# Altium schematic sheet stm32f407z.SchDoc
size A3
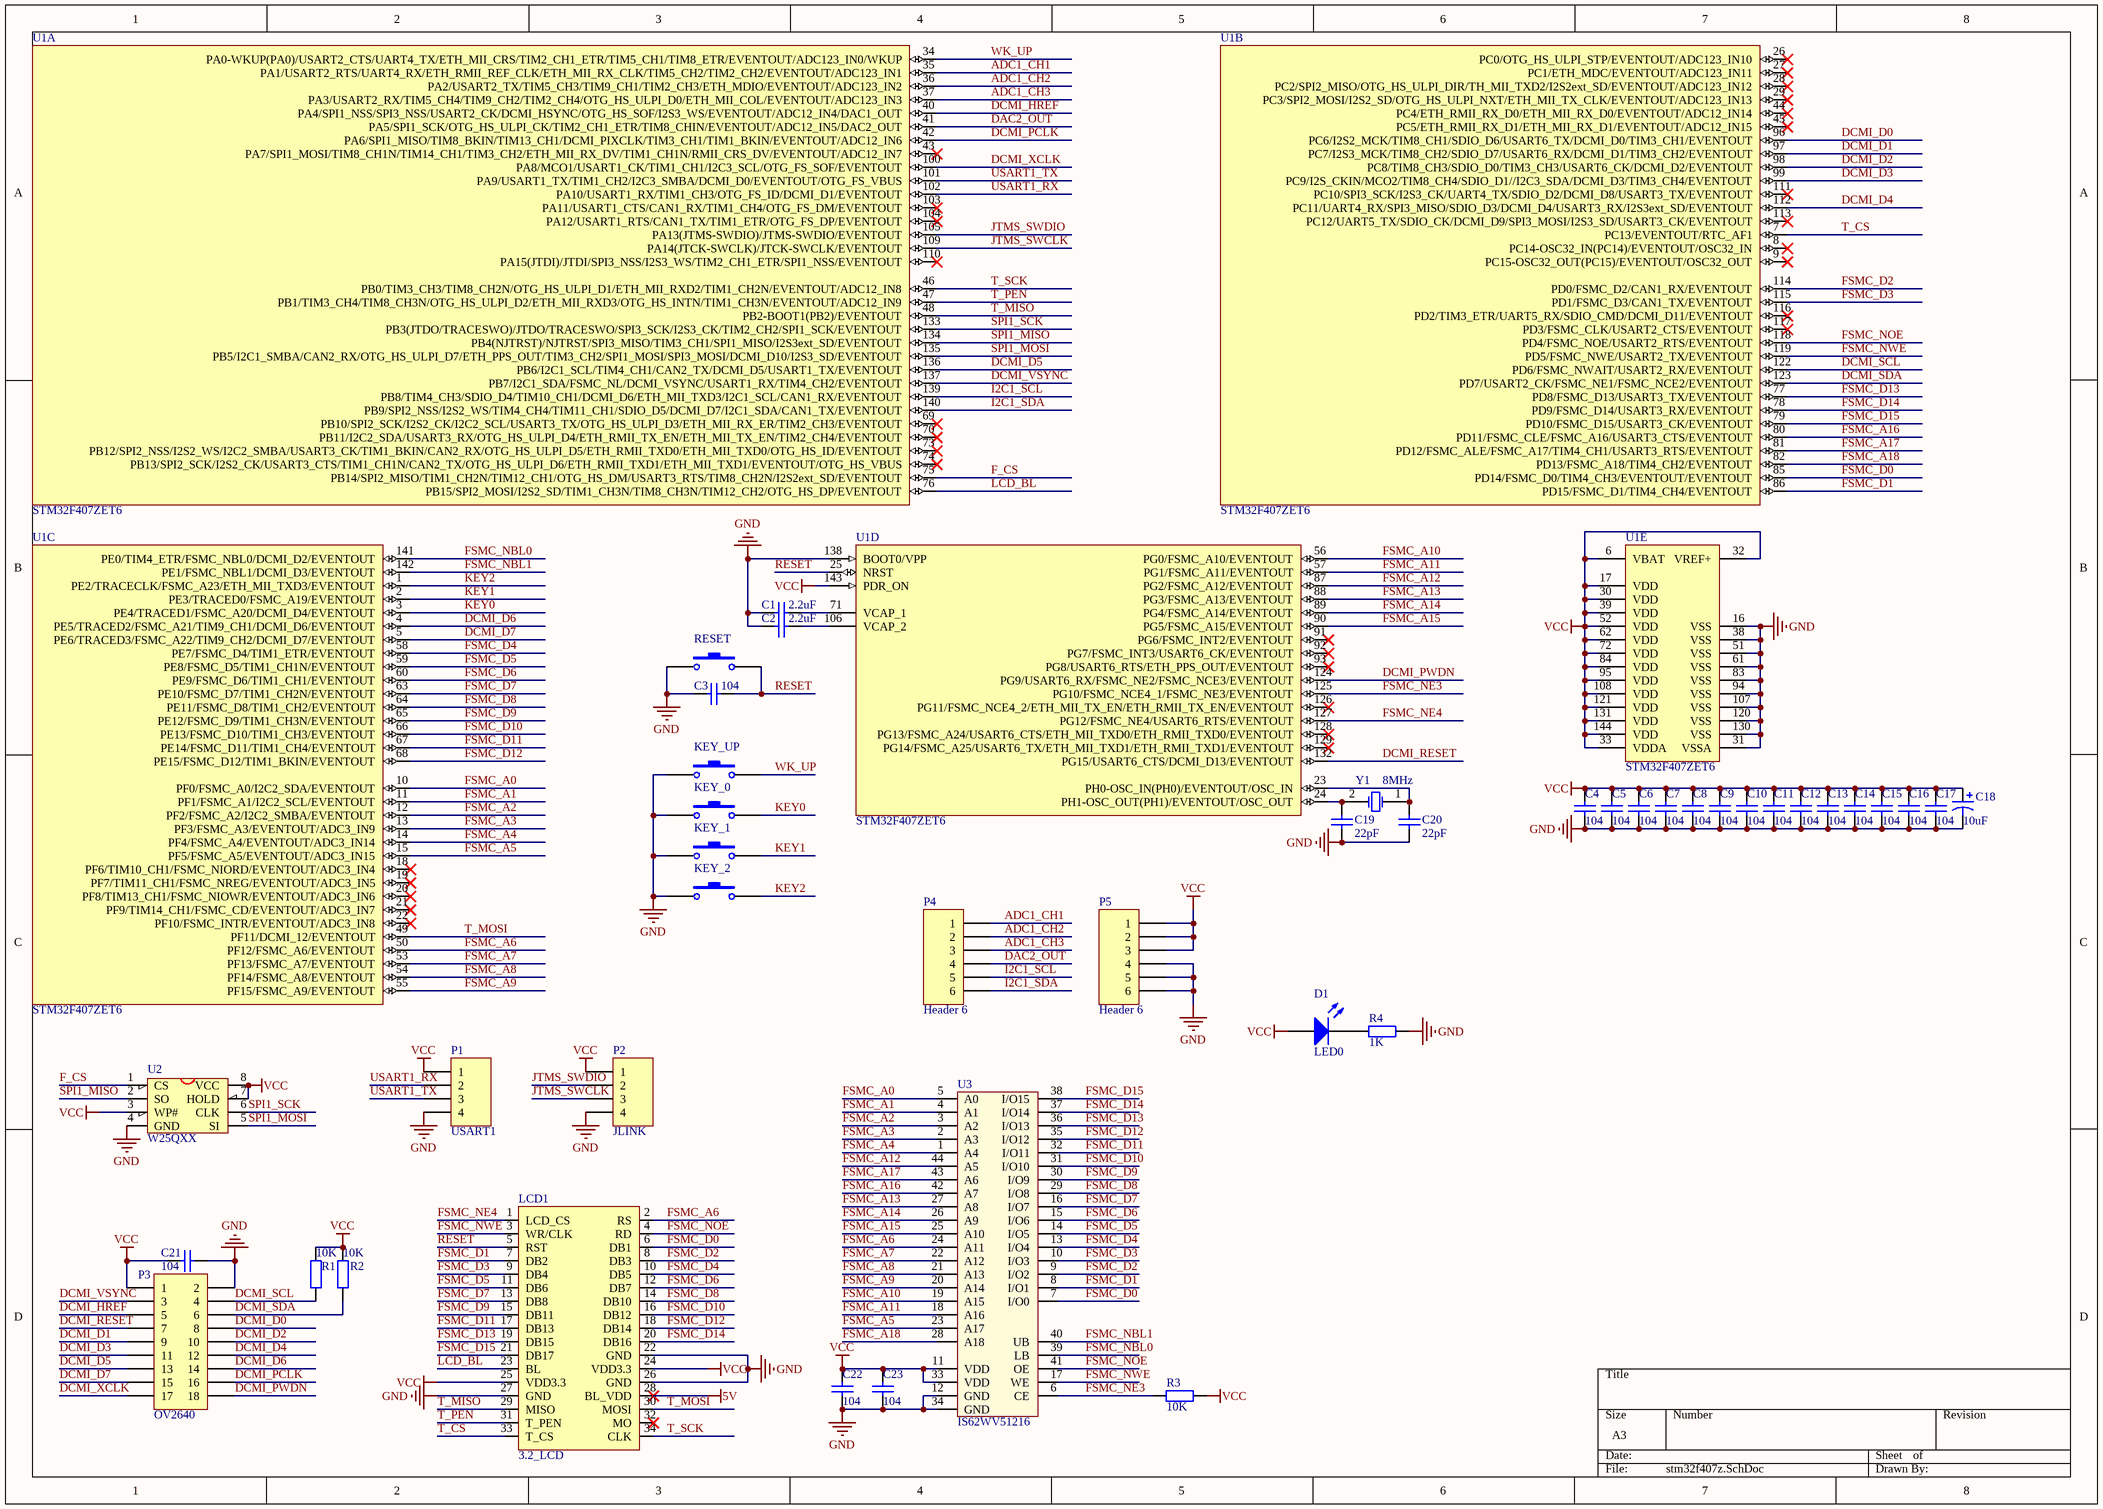
[diagram p0: stm32f407z.SchDoc]

## Parts
C1  2.2uF  [C0603]
C2  2.2uF  [C0603]
C3  104  [C0603]
C4  104  [C0603]
C5  104  [C0603]
C6  104  [C0603]
C7  104  [C0603]
C8  104  [C0603]
C9  104  [C0603]
C10  104  [C0603]
C11  104  [C0603]
C12  104  [C0603]
C13  104  [C0603]
C14  104  [C0603]
C15  104  [C0603]
C16  104  [C0603]
C17  104  [C0603]
C18  10uF  [LC-CASE-A_3216]
C19  22pF  [C0603]
C20  22pF  [C0603]
C21  104  [C0603]
C22  104  [C0603]
C23  104  [C0603]
D1  LED0  [LED0603]
KEY_0  RESET  [micro button_2_SMD]  (value not drawn)
KEY_1  RESET  [micro button_2_SMD]  (value not drawn)
KEY_2  RESET  [micro button_2_SMD]  (value not drawn)
KEY_UP  RESET  [micro button_2_SMD]  (value not drawn)
LCD1  3.2_LCD  [HDR2X17]
P1  USART1  [1.25PWT-4P]
P2  JLINK  [1.25PWT-4P]
P3  OV2640  [HDR2X9]
P4  Header 6  [PIN_6]
P5  Header 6  [PIN_6]
R1  10K  [R0603]
R2  10K  [R0603]
R3  10K  [R0603]
R4  1K  [R0603]
RESET  RESET  [micro button_2_SMD]  (value not drawn)
U1  STM32F407ZET6  [QFP144-0r5-20X20]  (parts A,B,C,D,E of 5)
U2  W25QXX  [SOIC_8]
U3  IS62WV51216  [TSOP44-0r8-10]
Y1  8MHz  [Crystal_HC_49USMD]

## Nets
5V: LCD1.28(BL_VDD)
GND: C1.1 C2.1 C3.1 C4.1 C5.1 C6.1 C7.1 C8.1 C9.1 C10.1 C11.1 C12.1 C13.1 C14.1 C15.1 C16.1 C17.1 C18.2 C19.1 C20.1 C21.1 C22.1 C23.1 KEY_0.1 KEY_1.1 KEY_2.1 KEY_UP.1 LCD1.22(GND) LCD1.26(GND) LCD1.27(GND) P1.4 P2.4 P3.2 P5.4 P5.5 P5.6 R4.1 RESET.1 U1.16(VSS) U1.31(VSSA) U1.38(VSS) U1.51(VSS) U1.61(VSS) U1.83(VSS) U1.94(VSS) U1.107(VSS) U1.120(VSS) U1.130(VSS) U1.138(BOOT0/VPP) U2.4(GND) U3.12(GND) U3.34(GND)
VCC: C4.2 C5.2 C6.2 C7.2 C8.2 C9.2 C10.2 C11.2 C12.2 C13.2 C14.2 C15.2 C16.2 C17.2 C18.1 C21.2 C22.2 C23.2 D1.1(A) LCD1.24(VDD3.3) LCD1.25(VDD3.3) P1.1 P2.1 P3.1 P5.1 P5.2 P5.3 R1.2 R2.2 R3.1 U1.6(VBAT) U1.17(VDD) U1.30(VDD) U1.32(VREF+) U1.33(VDDA) U1.39(VDD) U1.52(VDD) U1.62(VDD) U1.72(VDD) U1.84(VDD) U1.95(VDD) U1.108(VDD) U1.121(VDD) U1.131(VDD) U1.143(PDR_ON) U1.144(VDD) U2.3(WP#) U2.7(HOLD) U2.8(VCC) U3.11(VDD) U3.33(VDD)
ADC1_CH1: P4.1 U1.35(PA1/USART2_RTS/UART4_RX/ETH_RMII_REF_CLK/ETH_MII_RX_CLK/TIM5_CH2/TIM2_CH2/EVENTOUT/ADC123_IN1)
ADC1_CH2: P4.2 U1.36(PA2/USART2_TX/TIM5_CH3/TIM9_CH1/TIM2_CH3/ETH_MDIO/EVENTOUT/ADC123_IN2)
ADC1_CH3: P4.3 U1.37(PA3/USART2_RX/TIM5_CH4/TIM9_CH2/TIM2_CH4/OTG_HS_ULPI_D0/ETH_MII_COL/EVENTOUT/ADC123_IN3)
DAC2_OUT: P4.4 U1.41(PA5/SPI1_SCK/OTG_HS_ULPI_CK/TIM2_CH1_ETR/TIM8_CHIN/EVENTOUT/ADC12_IN5/DAC2_OUT)
DCMI_D0: P3.8 U1.96(PC6/I2S2_MCK/TIM8_CH1/SDIO_D6/USART6_TX/DCMI_D0/TIM3_CH1/EVENTOUT)
DCMI_D1: P3.9 U1.97(PC7/I2S3_MCK/TIM8_CH2/SDIO_D7/USART6_RX/DCMI_D1/TIM3_CH2/EVENTOUT)
DCMI_D2: P3.10 U1.98(PC8/TIM8_CH3/SDIO_D0/TIM3_CH3/USART6_CK/DCMI_D2/EVENTOUT)
DCMI_D3: P3.11 U1.99(PC9/I2S_CKIN/MCO2/TIM8_CH4/SDIO_D1//I2C3_SDA/DCMI_D3/TIM3_CH4/EVENTOUT)
DCMI_D4: P3.12 U1.112(PC11/UART4_RX/SPI3_MISO/SDIO_D3/DCMI_D4/USART3_RX/I2S3ext_SD/EVENTOUT)
DCMI_D5: P3.13 U1.136(PB6/I2C1_SCL/TIM4_CH1/CAN2_TX/DCMI_D5/USART1_TX/EVENTOUT)
DCMI_D6: P3.14 U1.4(PE5/TRACED2/FSMC_A21/TIM9_CH1/DCMI_D6/EVENTOUT)
DCMI_D7: P3.15 U1.5(PE6/TRACED3/FSMC_A22/TIM9_CH2/DCMI_D7/EVENTOUT)
DCMI_HREF: P3.5 U1.40(PA4/SPI1_NSS/SPI3_NSS/USART2_CK/DCMI_HSYNC/OTG_HS_SOF/I2S3_WS/EVENTOUT/ADC12_IN4/DAC1_OUT)
DCMI_PCLK: P3.16 U1.42(PA6/SPI1_MISO/TIM8_BKIN/TIM13_CH1/DCMI_PIXCLK/TIM3_CH1/TIM1_BKIN/EVENTOUT/ADC12_IN6)
DCMI_PWDN: P3.18 U1.124(PG9/USART6_RX/FSMC_NE2/FSMC_NCE3/EVENTOUT)
DCMI_RESET: P3.7 U1.132(PG15/USART6_CTS/DCMI_D13/EVENTOUT)
DCMI_SCL: P3.4 R1.1 U1.122(PD6/FSMC_NWAIT/USART2_RX/EVENTOUT)
DCMI_SDA: P3.6 R2.1 U1.123(PD7/USART2_CK/FSMC_NE1/FSMC_NCE2/EVENTOUT)
DCMI_VSYNC: P3.3 U1.137(PB7/I2C1_SDA/FSMC_NL/DCMI_VSYNC/USART1_RX/TIM4_CH2/EVENTOUT)
DCMI_XCLK: P3.17 U1.100(PA8/MCO1/USART1_CK/TIM1_CH1/I2C3_SCL/OTG_FS_SOF/EVENTOUT)
F_CS: U1.75(PB14/SPI2_MISO/TIM1_CH2N/TIM12_CH1/OTG_HS_DM/USART3_RTS/TIM8_CH2N/I2S2ext_SD/EVENTOUT) U2.1(CS)
FSMC_A0: U1.10(PF0/FSMC_A0/I2C2_SDA/EVENTOUT) U3.5(A0)
FSMC_A1: U1.11(PF1/FSMC_A1/I2C2_SCL/EVENTOUT) U3.4(A1)
FSMC_A2: U1.12(PF2/FSMC_A2/I2C2_SMBA/EVENTOUT) U3.3(A2)
FSMC_A3: U1.13(PF3/FSMC_A3/EVENTOUT/ADC3_IN9) U3.2(A3)
FSMC_A4: U1.14(PF4/FSMC_A4/EVENTOUT/ADC3_IN14) U3.1(A4)
FSMC_A5: U1.15(PF5/FSMC_A5/EVENTOUT/ADC3_IN15) U3.23(A17)
FSMC_A6: LCD1.2(RS) U1.50(PF12/FSMC_A6/EVENTOUT) U3.24(A11)
FSMC_A7: U1.53(PF13/FSMC_A7/EVENTOUT) U3.22(A12)
FSMC_A8: U1.54(PF14/FSMC_A8/EVENTOUT) U3.21(A13)
FSMC_A9: U1.55(PF15/FSMC_A9/EVENTOUT) U3.20(A14)
FSMC_A10: U1.56(PG0/FSMC_A10/EVENTOUT) U3.19(A15)
FSMC_A11: U1.57(PG1/FSMC_A11/EVENTOUT) U3.18(A16)
FSMC_A12: U1.87(PG2/FSMC_A12/EVENTOUT) U3.44(A5)
FSMC_A13: U1.88(PG3/FSMC_A13/EVENTOUT) U3.27(A8)
FSMC_A14: U1.89(PG4/FSMC_A14/EVENTOUT) U3.26(A9)
FSMC_A15: U1.90(PG5/FSMC_A15/EVENTOUT) U3.25(A10)
FSMC_A16: U1.80(PD11/FSMC_CLE/FSMC_A16/USART3_CTS/EVENTOUT) U3.42(A7)
FSMC_A17: U1.81(PD12/FSMC_ALE/FSMC_A17/TIM4_CH1/USART3_RTS/EVENTOUT) U3.43(A6)
FSMC_A18: U1.82(PD13/FSMC_A18/TIM4_CH2/EVENTOUT) U3.28(A18)
FSMC_D0: LCD1.6(DB1) U1.85(PD14/FSMC_D0/TIM4_CH3/EVENTOUT/EVENTOUT) U3.7(I/O0)
FSMC_D1: LCD1.7(DB2) U1.86(PD15/FSMC_D1/TIM4_CH4/EVENTOUT) U3.8(I/O1)
FSMC_D2: LCD1.8(DB3) U1.114(PD0/FSMC_D2/CAN1_RX/EVENTOUT) U3.9(I/O2)
FSMC_D3: LCD1.9(DB4) U1.115(PD1/FSMC_D3/CAN1_TX/EVENTOUT) U3.10(I/O3)
FSMC_D4: LCD1.10(DB5) U1.58(PE7/FSMC_D4/TIM1_ETR/EVENTOUT) U3.13(I/O4)
FSMC_D5: LCD1.11(DB6) U1.59(PE8/FSMC_D5/TIM1_CH1N/EVENTOUT) U3.14(I/O5)
FSMC_D6: LCD1.12(DB7) U1.60(PE9/FSMC_D6/TIM1_CH1/EVENTOUT) U3.15(I/O6)
FSMC_D7: LCD1.13(DB8) U1.63(PE10/FSMC_D7/TIM1_CH2N/EVENTOUT) U3.16(I/O7)
FSMC_D8: LCD1.14(DB10) U1.64(PE11/FSMC_D8/TIM1_CH2/EVENTOUT) U3.29(I/O8)
FSMC_D9: LCD1.15(DB11) U1.65(PE12/FSMC_D9/TIM1_CH3N/EVENTOUT) U3.30(I/O9)
FSMC_D10: LCD1.16(DB12) U1.66(PE13/FSMC_D10/TIM1_CH3/EVENTOUT) U3.31(I/O10)
FSMC_D11: LCD1.17(DB13) U1.67(PE14/FSMC_D11/TIM1_CH4/EVENTOUT) U3.32(I/O11)
FSMC_D12: LCD1.18(DB14) U1.68(PE15/FSMC_D12/TIM1_BKIN/EVENTOUT) U3.35(I/O12)
FSMC_D13: LCD1.19(DB15) U1.77(PD8/FSMC_D13/USART3_TX/EVENTOUT) U3.36(I/O13)
FSMC_D14: LCD1.20(DB16) U1.78(PD9/FSMC_D14/USART3_RX/EVENTOUT) U3.37(I/O14)
FSMC_D15: LCD1.21(DB17) U1.79(PD10/FSMC_D15/USART3_CK/EVENTOUT) U3.38(I/O15)
FSMC_NBL0: U1.141(PE0/TIM4_ETR/FSMC_NBL0/DCMI_D2/EVENTOUT) U3.39(LB)
FSMC_NBL1: U1.142(PE1/FSMC_NBL1/DCMI_D3/EVENTOUT) U3.40(UB)
FSMC_NE3: R3.2 U1.125(PG10/FSMC_NCE4_1/FSMC_NE3/EVENTOUT) U3.6(CE)
FSMC_NE4: LCD1.1(LCD_CS) U1.127(PG12/FSMC_NE4/USART6_RTS/EVENTOUT)
FSMC_NOE: LCD1.4(RD) U1.118(PD4/FSMC_NOE/USART2_RTS/EVENTOUT) U3.41(OE)
FSMC_NWE: LCD1.3(WR/CLK) U1.119(PD5/FSMC_NWE/USART2_TX/EVENTOUT) U3.17(WE)
I2C1_SCL: P4.5 U1.139(PB8/TIM4_CH3/SDIO_D4/TIM10_CH1/DCMI_D6/ETH_MII_TXD3/I2C1_SCL/CAN1_RX/EVENTOUT)
I2C1_SDA: P4.6 U1.140(PB9/SPI2_NSS/I2S2_WS/TIM4_CH4/TIM11_CH1/SDIO_D5/DCMI_D7/I2C1_SDA/CAN1_TX/EVENTOUT)
JTMS_SWCLK: P2.3 U1.109(PA14(JTCK-SWCLK)/JTCK-SWCLK/EVENTOUT)
JTMS_SWDIO: P2.2 U1.105(PA13(JTMS-SWDIO)/JTMS-SWDIO/EVENTOUT)
KEY0: KEY_0.2 U1.3(PE4/TRACED1/FSMC_A20/DCMI_D4/EVENTOUT)
KEY1: KEY_1.2 U1.2(PE3/TRACED0/FSMC_A19/EVENTOUT)
KEY2: KEY_2.2 U1.1(PE2/TRACECLK/FSMC_A23/ETH_MII_TXD3/EVENTOUT)
LCD_BL: LCD1.23(BL) U1.76(PB15/SPI2_MOSI/I2S2_SD/TIM1_CH3N/TIM8_CH3N/TIM12_CH2/OTG_HS_DP/EVENTOUT)
RESET: C3.2 LCD1.5(RST) RESET.2 U1.25(NRST)
SPI1_MISO: U1.134(PB4(NJTRST)/NJTRST/SPI3_MISO/TIM3_CH1/SPI1_MISO/I2S3ext_SD/EVENTOUT) U2.2(SO)
SPI1_MOSI: U1.135(PB5/I2C1_SMBA/CAN2_RX/OTG_HS_ULPI_D7/ETH_PPS_OUT/TIM3_CH2/SPI1_MOSI/SPI3_MOSI/DCMI_D10/I2S3_SD/EVENTOUT) U2.5(SI)
SPI1_SCK: U1.133(PB3(JTDO/TRACESWO)/JTDO/TRACESWO/SPI3_SCK/I2S3_CK/TIM2_CH2/SPI1_SCK/EVENTOUT) U2.6(CLK)
T_CS: LCD1.33(T_CS) U1.7(PC13/EVENTOUT/RTC_AF1)
T_MISO: LCD1.29(MISO) U1.48(PB2-BOOT1(PB2)/EVENTOUT)
T_MOSI: LCD1.30(MOSI) U1.49(PF11/DCMI_12/EVENTOUT)
T_PEN: LCD1.31(T_PEN) U1.47(PB1/TIM3_CH4/TIM8_CH3N/OTG_HS_ULPI_D2/ETH_MII_RXD3/OTG_HS_INTN/TIM1_CH3N/EVENTOUT/ADC12_IN9)
T_SCK: LCD1.34(CLK) U1.46(PB0/TIM3_CH3/TIM8_CH2N/OTG_HS_ULPI_D1/ETH_MII_RXD2/TIM1_CH2N/EVENTOUT/ADC12_IN8)
USART1_RX: P1.2 U1.102(PA10/USART1_RX/TIM1_CH3/OTG_FS_ID/DCMI_D1/EVENTOUT)
USART1_TX: P1.3 U1.101(PA9/USART1_TX/TIM1_CH2/I2C3_SMBA/DCMI_D0/EVENTOUT/OTG_FS_VBUS)
WK_UP: KEY_UP.2 U1.34(PA0-WKUP(PA0)/USART2_CTS/UART4_TX/ETH_MII_CRS/TIM2_CH1_ETR/TIM5_CH1/TIM8_ETR/EVENTOUT/ADC123_IN0/WKUP)
NetC1_2: C1.2 U1.71(VCAP_1)
NetC2_2: C2.2 U1.106(VCAP_2)
NetC19_2: C19.2 U1.24(PH1-OSC_OUT(PH1)/EVENTOUT/OSC_OUT) Y1.2(OSC2)
NetC20_2: C20.2 U1.23(PH0-OSC_IN(PH0)/EVENTOUT/OSC_IN) Y1.1(OSC1)
NetD1_2: D1.2(K) R4.2

Not connected (* = marked no-connect by the designer): LCD1 32(MO)*; U1 8(PC14-OSC32_IN(PC14)/EVENTOUT/OSC32_IN)* 9(PC15-OSC32_OUT(PC15)/EVENTOUT/OSC32_OUT)* 18(PF6/TIM10_CH1/FSMC_NIORD/EVENTOUT/ADC3_IN4)* 19(PF7/TIM11_CH1/FSMC_NREG/EVENTOUT/ADC3_IN5)* 20(PF8/TIM13_CH1/FSMC_NIOWR/EVENTOUT/ADC3_IN6)* 21(PF9/TIM14_CH1/FSMC_CD/EVENTOUT/ADC3_IN7)* 22(PF10/FSMC_INTR/EVENTOUT/ADC3_IN8)* 26(PC0/OTG_HS_ULPI_STP/EVENTOUT/ADC123_IN10)* 27(PC1/ETH_MDC/EVENTOUT/ADC123_IN11)* 28(PC2/SPI2_MISO/OTG_HS_ULPI_DIR/TH_MII_TXD2/I2S2ext_SD/EVENTOUT/ADC123_IN12)* 29(PC3/SPI2_MOSI/I2S2_SD/OTG_HS_ULPI_NXT/ETH_MII_TX_CLK/EVENTOUT/ADC123_IN13)* 43(PA7/SPI1_MOSI/TIM8_CH1N/TIM14_CH1/TIM3_CH2/ETH_MII_RX_DV/TIM1_CH1N/RMII_CRS_DV/EVENTOUT/ADC12_IN7)* 44(PC4/ETH_RMII_RX_D0/ETH_MII_RX_D0/EVENTOUT/ADC12_IN14)* 45(PC5/ETH_RMII_RX_D1/ETH_MII_RX_D1/EVENTOUT/ADC12_IN15)* 69(PB10/SPI2_SCK/I2S2_CK/I2C2_SCL/USART3_TX/OTG_HS_ULPI_D3/ETH_MII_RX_ER/TIM2_CH3/EVENTOUT)* 70(PB11/I2C2_SDA/USART3_RX/OTG_HS_ULPI_D4/ETH_RMII_TX_EN/ETH_MII_TX_EN/TIM2_CH4/EVENTOUT)* 73(PB12/SPI2_NSS/I2S2_WS/I2C2_SMBA/USART3_CK/TIM1_BKIN/CAN2_RX/OTG_HS_ULPI_D5/ETH_RMII_TXD0/ETH_MII_TXD0/OTG_HS_ID/EVENTOUT)* 74(PB13/SPI2_SCK/I2S2_CK/USART3_CTS/TIM1_CH1N/CAN2_TX/OTG_HS_ULPI_D6/ETH_RMII_TXD1/ETH_MII_TXD1/EVENTOUT/OTG_HS_VBUS)* 91(PG6/FSMC_INT2/EVENTOUT)* 92(PG7/FSMC_INT3/USART6_CK/EVENTOUT)* 93(PG8/USART6_RTS/ETH_PPS_OUT/EVENTOUT)* 103(PA11/USART1_CTS/CAN1_RX/TIM1_CH4/OTG_FS_DM/EVENTOUT)* 104(PA12/USART1_RTS/CAN1_TX/TIM1_ETR/OTG_FS_DP/EVENTOUT)* 110(PA15(JTDI)/JTDI/SPI3_NSS/I2S3_WS/TIM2_CH1_ETR/SPI1_NSS/EVENTOUT)* 111(PC10/SPI3_SCK/I2S3_CK/UART4_TX/SDIO_D2/DCMI_D8/USART3_TX/EVENTOUT)* 113(PC12/UART5_TX/SDIO_CK/DCMI_D9/SPI3_MOSI/I2S3_SD/USART3_CK/EVENTOUT)* 116(PD2/TIM3_ETR/UART5_RX/SDIO_CMD/DCMI_D11/EVENTOUT)* 117(PD3/FSMC_CLK/USART2_CTS/EVENTOUT)* 126(PG11/FSMC_NCE4_2/ETH_MII_TX_EN/ETH_RMII_TX_EN/EVENTOUT)* 128(PG13/FSMC_A24/USART6_CTS/ETH_MII_TXD0/ETH_RMII_TXD0/EVENTOUT)* 129(PG14/FSMC_A25/USART6_TX/ETH_MII_TXD1/ETH_RMII_TXD1/EVENTOUT)*

## Library data of the parts
C1-C17 C19-C23 = Cap: Capacitor; Published: 8-Jun-2000; LatestRevisionDate: 17-Jul-2002; LatestRevisionNote: Re-released for DXP Platform.; PackageReference: RAD-0.3; Publisher: Altium Limited; PackageDescription: Radial Cap, Thru-Hole; 2 Leads; 0.3 in Pin Spacing
  C1 C2: Value: 2.2uF
  C3-C17 C21-C23: Value: 104
  C19 C20: Value: 22pF
C18 = Cap Pol1: Polarized Capacitor (Radial); Published: 8-Jun-2000; LatestRevisionDate: 17-Jul-2002; LatestRevisionNote: Re-released for DXP Platform.; PackageReference: RB7.6-15; Publisher: Altium Limited; PackageDescription: Polarized Capacitor (Radial); 2 Leads; Value: 10uF
D1 = LED0: Typical INFRARED GaAs LED; Published: 8-Jun-2000; LatestRevisionDate: 08-Jul-2005; LatestRevisionNote: Mech Layer 1 removed.; PackageReference: LED-0; Publisher: Altium Limited; PackageDescription: LED; 2 Leads
KEY_0-KEY_2 KEY_UP RESET = SW-PB: Switch; Published: 24-Mar-1999; LatestRevisionDate: 17-Jul-2002; LatestRevisionNote: Re-released for DXP Platform.; PackageReference: SPST-2; Publisher: Altium Limited; PackageDescription: Switch; 2 Leads
P1 P2 = Header 4: Header, 4-Pin; pin to pad: 1>4 2>3 3>2 4>1; LatestRevisionDate: 17-Jul-2002; LatestRevisionNote: Re-released for DXP Platform.; Publisher: Altium Limited
P3 = Header 9X2: Header, 9-Pin, Dual row; LatestRevisionDate: 17-Jul-2002; LatestRevisionNote: Re-released for DXP Platform.; Publisher: Altium Limited
P4 P5 = Header 6: Header, 6-Pin; LatestRevisionDate: 17-Jul-2002; LatestRevisionNote: Re-released for DXP Platform.; Publisher: Altium Limited
R1-R4 = Res2: Resistor; Published: 8-Jun-2000; LatestRevisionDate: 17-Jul-2002; LatestRevisionNote: Re-released for DXP Platform.; PackageReference: AXIAL-0.4; Publisher: Altium Limited; PackageDescription: Axial Device, Thru-Hole; 2 Leads; 0.4 in Pin Spacing
  R1-R3: Value: 10K
  R4: Value: 1K
U1 = STM32F407ZET6: ARM Cortex-M4 32b MCU+FPU, 210DMIP, 512 kB Flash, 192+4 kB RAM, Camera, 114 I/Os, 144-pin LQFP, -40 to +85癈, Tray; Internal RAM: 192kB; Operating Frequency (Processor Speed): 168MHz; A/D Converter: 24x12-bit; D/A Converter: 2x12-bit; 16-bit Timers (IC/OC/PWM): 12x16-bit(24/24/30); 32-bit Timer (IC/OC/PWM): 2x32-bit (8/8/8); Other Timer Functions: 2xWDG, RTC, 24-bit down counter; Serial Interface: 3xSPI/2xI2S/2xI2C/3xUSART(IrDa, ISO7816)/3xUART/2xUSB OTG FS/HS, 2xCAN/Ethernet MAC10/100, SDIO; DatasheetVersion: rev2, Jan-2012; PackageVersion: 2012; PackageReference: TQFP144; PackageDescription: 144-Pin Low Profile Quad Flat Package, 20x20 mm Body, 0.5 mm Pitch; ComponentLink1Description: Manufacturer URL; ComponentLink1URL: http://www.st.com/; ComponentLink2Description: STM32F405/7 Datasheet; ComponentLink2URL: http://www.st.com/internet/com/TECHNICAL_RESOURCES/TECHNICAL_LITERATURE/DATASHEET/DM00037051.pdf; ComponentLink3Description: STM32F4 Web Page; ComponentLink3URL: http://www.st.com/internet/mcu/subclass/1521.jsp
U2 = W25X16: W25X16;SST25VF016;MX25L1605
Y1 = XTAL: Crystal Oscillator; Published: 8-Jun-2000; LatestRevisionDate: 17-Jul-2002; LatestRevisionNote: Re-released for DXP Platform.; PackageReference: R38; Publisher: Altium Limited; PackageDescription: Crystal, Thru-Hole; 2 Leads; Body 3.1 x 8.2 mm (Dia.xH)